# Altium schematic sheet Skumpad.SchDoc
size 279 x 152 mm; ApprovedBy: Skaytacium; CheckedBy: NNNI; Author: Skaytacium; CompanyName: Skaytacium Inc.; Organization: Skaytacium Inc.; DocumentNumber: Skumpad; Revision: 3
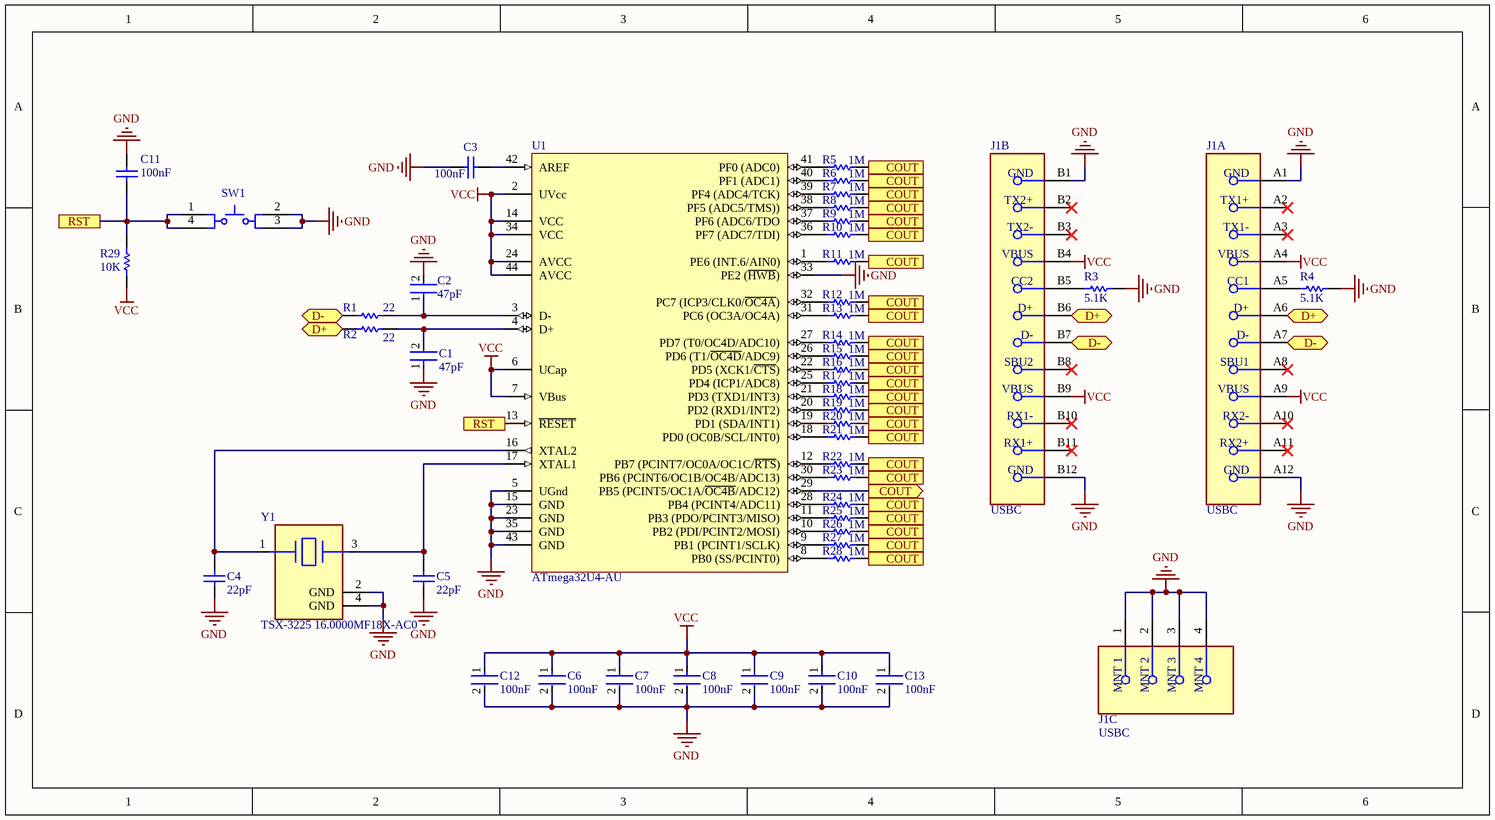
[diagram p0: Skumpad.SchDoc]

## Parts
C1  47pF  [FP-C0402-BB-MFG]
C2  47pF  [FP-C0402-BB-MFG]
C3  100nF  [CAPC1050X55X23ML05T13]
C4  22pF  [CAPC1005X56X25NL10T15]
C5  22pF  [CAPC1005X56X25NL10T15]
C6  100nF  [FP-C0402-BB-MFG]
C7  100nF  [FP-C0402-BB-MFG]
C8  100nF  [FP-C0402-BB-MFG]
C9  100nF  [FP-C0402-BB-MFG]
C10  100nF  [FP-C0402-BB-MFG]
C11  100nF  [CAPC1050X55X23ML05T13]
C12  100nF  [FP-C0402-BB-MFG]
C13  100nF  [FP-C0402-BB-MFG]
J1  USBC  [FP-1054500101-MFG]  (parts A,B,C of 3)
R1  22  [RESC1005X40X25LL05T05]
R2  22  [RESC1005X40X25LL05T05]
R3  5.1K  [RESC1005X40X25NL10T10]
R4  5.1K  [RESC1005X40X25NL10T10]
R5  1M  [RESC0402(1005)_M]
R6  1M  [RESC0402(1005)_M]
R7  1M  [RESC0402(1005)_M]
R8  1M  [RESC0402(1005)_M]
R9  1M  [RESC0402(1005)_M]
R10  1M  [RESC0402(1005)_M]
R11  1M  [RESC0402(1005)_M]
R12  1M  [RESC0402(1005)_M]
R13  1M  [RESC0402(1005)_M]
R14  1M  [RESC0402(1005)_M]
R15  1M  [RESC0402(1005)_M]
R16  1M  [RESC0402(1005)_M]
R17  1M  [RESC0402(1005)_M]
R18  1M  [RESC0402(1005)_M]
R19  1M  [RESC0402(1005)_M]
R20  1M  [RESC0402(1005)_M]
R21  1M  [RESC0402(1005)_M]
R22  1M  [RESC0402(1005)_M]
R23  1M  [RESC0402(1005)_M]
R24  1M  [RESC0402(1005)_M]
R25  1M  [RESC0402(1005)_M]
R26  1M  [RESC0402(1005)_M]
R27  1M  [RESC0402(1005)_M]
R28  1M  [RESC0402(1005)_M]
R29  10K  [RESC1005X40X25NL05T05]
SW1  7914G-1-000E  [BOUR-7914G-1-000E_V]  (value not drawn)
U1  ATmega32U4-AU  [44ML_M]
Y1  TSX-3225 16.0000MF18X-AC0  [FP-TSX-3225-MFG]

## Ports
COUT (out), D+ (bidir), D- (bidir), RST

## Nets
GND: C1.1 C2.2 C3.1 C4.1 C5.1 C6.2 C7.2 C8.2 C9.2 C10.2 C11.2 C12.2 C13.2 J1.1(MNT_1) J1.2(MNT_2) J1.3(MNT_3) J1.4(MNT_4) J1.A1(GND) J1.A12(GND) J1.B1(GND) J1.B12(GND) R3.2 R4.2 SW1.2(+) SW1.3(+) U1.5(UGnd) U1.15(GND) U1.23(GND) U1.33(PE2_(~{HWB})) U1.35(GND) U1.43(GND) Y1.2(GND) Y1.4(GND)
VCC: C6.1 C7.1 C8.1 C9.1 C10.1 C12.1 C13.1 J1.A4(VBUS) J1.A9(VBUS) J1.B4(VBUS) J1.B9(VBUS) R29.1 U1.2(UVcc) U1.6(UCap) U1.7(VBus) U1.14(VCC) U1.24(AVCC) U1.34(VCC) U1.44(AVCC)
COUT: R5.2 R6.2 R7.2 R8.2 R9.2 R10.2 R11.2 R12.2 R13.2 R14.2 R15.2 R16.2 R17.2 R18.2 R19.2 R20.2 R21.2 R22.2 R23.2 R24.2 R25.2 R26.2 R27.2 R28.2 U1.29(PB5_(PCINT5/OC1A/~{OC4B}/ADC12)) ; port COUT
D+: J1.A6(D+) J1.B6(D+) R2.2 ; port D+
D-: J1.A7(D-) J1.B7(D-) R1.2 ; port D-
RST: C11.1 R29.2 SW1.1(-) SW1.4(-) U1.13(~{RESET}) ; port RST
NetC1_2: C1.2 R2.1 U1.4(D+)
NetC2_1: C2.1 R1.1 U1.3(D-)
NetC3_2: C3.2 U1.42(AREF)
NetC4_2: C4.2 U1.16(XTAL2) Y1.1
NetC5_2: C5.2 U1.17(XTAL1) Y1.3
NetJ1_A5: J1.A5(CC1) R4.1
NetJ1_B5: J1.B5(CC2) R3.1
NetR5_1: R5.1 U1.41(PF0_(ADC0))
NetR6_1: R6.1 U1.40(PF1_(ADC1))
NetR7_1: R7.1 U1.39(PF4_(ADC4/TCK))
NetR8_1: R8.1 U1.38(PF5_(ADC5/TMS)))
NetR9_1: R9.1 U1.37(PF6_(ADC6/TDO)
NetR10_1: R10.1 U1.36(PF7_(ADC7/TDI))
NetR11_1: R11.1 U1.1(PE6_(INT.6/AIN0))
NetR12_1: R12.1 U1.32(PC7_(ICP3/CLK0/~{OC4A}))
NetR13_1: R13.1 U1.31(PC6_(OC3A/OC4A))
NetR14_1: R14.1 U1.27(PD7_(T0/OC4D/ADC10))
NetR15_1: R15.1 U1.26(PD6_(T1/~{OC4D}/ADC9))
NetR16_1: R16.1 U1.22(PD5_(XCK1/~{CTS}))
NetR17_1: R17.1 U1.25(PD4_(ICP1/ADC8))
NetR18_1: R18.1 U1.21(PD3_(TXD1/INT3))
NetR19_1: R19.1 U1.20(PD2_(RXD1/INT2))
NetR20_1: R20.1 U1.19(PD1_(SDA/INT1))
NetR21_1: R21.1 U1.18(PD0_(OC0B/SCL/INT0))
NetR22_1: R22.1 U1.12(PB7_(PCINT7/OC0A/OC1C/~{RTS}))
NetR23_1: R23.1 U1.30(PB6_(PCINT6/OC1B/OC4B/ADC13))
NetR24_1: R24.1 U1.28(PB4_(PCINT4/ADC11))
NetR25_1: R25.1 U1.11(PB3_(PDO/PCINT3/MISO))
NetR26_1: R26.1 U1.10(PB2_(PDI/PCINT2/MOSI))
NetR27_1: R27.1 U1.9(PB1_(PCINT1/SCLK))
NetR28_1: R28.1 U1.8(PB0_(SS/PCINT0))

Not connected (* = marked no-connect by the designer): J1 A2(TX1+)* A3(TX1-)* A8(SBU1)* A10(RX2-)* A11(RX2+)* B2(TX2+)* B3(TX2-)* B8(SBU2)* B10(RX1-)* B11(RX1+)*

## Library data of the parts
C1 C2 = CMP-2008-03283-2: CAP CER 47PF 50V C0G/NP0 0402; Manufacturer: Kemet; Manufacturer Part Number: C0402C470J5GACTU; Temperature Coefficient: 15%; Tolerance: 0.05; Material: Ceramic; Temperature Characteristic: C0G; Mouser Description: Multilayer Ceramic Capacitors MLCC - SMD/SMT 50volts 47pF C0G 5%; Capacitance: 47 pF; Automotive: No; ComponentLink2URL: https://content.kemet.com/datasheets/KEM_C1002_X7R_SMD.pdf; Temperature Range High: +125°C; Value: 47 pF; Octopart: https://octopart.com/c0402c470j5gactu-kemet-134668; Category: Cap; Device Class L2: Capacitors; Device Class L3: Ceramic Capacitors; Digikey Description: CAP CER 47PF 50V C0G/NP0 0402; Ipc Land Pattern Name: CAPC10050X50; Voltage Rating: 50 V; Lead Free: Yes; RoHS: TRUE; Device Class L1: Passive Components; Package: C0402-BB; Temperature: -55°C to +125°C; Height: 0.55mm; Temperature Range Low: -55°C; ComponentLink2Description: Datasheet
C3 C11 = CMP-2000-05439-1: Chip Capacitor, 100 nF, +/- 10%, 16 V, -55 to 125 degC, 0402 (1005 Metric), RoHS, Tape and Reel; Manufacturer: Samsung Electro-Mechanics; Capacitance: 100000pF; Dielectric: X7R; Rated Voltage: 16V; Case Size/Dimension: 0402; Tolerance (%): ±10%; Manufacturer URL: http://www.samsungsem.com/global/index.jsp; Datasheet URL: https://datasheet.ciiva.com/29198/458718-da-01-en-vs-kondensator-0402-29198423.pdf; Datasheet Version: Nov-10
C4 C5 = CMP-2008-02613-1: Part Number: 04025A220JAT2A; Manufacturer: AVX Interconnect / Elco
C6-C10 C12 C13 = CMP-03020-023811-1: CAP CER 0.1UF 10V X5R 0402; Manufacturer: Kemet; Manufacturer Part Number: C0402C104K8PACTU; Material: Ceramic; Capacitance: 0.10 μF; Temperature Coefficient: 15%; Tolerance: 0.1; Value: 0.10 μF; Package: C0402-BB; Temperature: -55°C to +125°C; ComponentLink2Description: Datasheet; Temperature Characteristic: X5R; Device Class L1: Passive Components; Height: 0.55mm; Lead Free: Yes; ComponentLink2URL: https://content.kemet.com/datasheets/KEM_C1002_X7R_SMD.pdf; Device Class L2: Capacitors; Temperature Range Low: -55°C; Temperature Range High: +125°C; RoHS: TRUE; Octopart: https://octopart.com/c0402c104k8pactu-kemet-140039; Automotive: No; Mouser Description: Capacitor 100 nF 10 VDC 0402; Category: Cap; Voltage Rating: 10 V; Digikey Description: CAP CER 0.1UF 10V X5R 0402; Ipc Land Pattern Name: CAPC10050X50; Device Class L3: Ceramic Capacitors
J1 = CMP-04767-000004-1: CONN RCP USB3.1 TYPEC 24P SMD RA; Manufacturer: Molex; Manufacturer Part Number: 1054500101; Number Of Contacts: 24; Voltage Rating: 30V; Shielding: true; Is Female: yes; Current Rating: 0.25/1.25/5A; Pitch: 0.5mm; Conn Orientation: Right Angle; Package: 0; Height: 3.44mm; Footprint Url: https://www.molex.com/pdm_docs/sd/1054500101_sd.pdf; Device Class L1: Connectors; Category: Conn; Device Class L2: USB Connectors; Digikey Description: CONN RCP USB3.1 TYPEC 24P SMD RA; Contact Material: Gold,Nickel; Mouser Description: USB Shielded I/O Receptacle; Type C; Right Angle; Surface Mount; Gold over Nickel; ComponentLink2Description: Datasheet; Lead Free: Yes; Automotive: No; Temperature Range High: +85°C; RoHS: TRUE; Octopart: https://octopart.com/105450-0101-molex-68082325; ComponentLink2URL: https://www.molex.com/webdocs/datasheets/pdf/en-us/1054500101_IO_CONNECTORS.pdf; Temperature: -30°C to +85°C; Usb Standard: USB 3.1; Temperature Range Low: -30°C; Device Class L3: unset
R1 R2 = CMP-2002-08382-1: Manufacturer: Vishay Dale; Part Number: CRCW040222R0FKED
R3 R4 = CMP-2002-05812-1: Manufacturer: Panasonic; Part Number: ERA-2AEB512X
R5-R28 = CMP-1011-00849-1: 1M 0.063W 1% 0402 (1005 Metric)  SMD; Case-Metric: 1005; Value: 1000000.00 Ohm; Case-EIA: 0402; Tolerance: 1 %; Power: 0.063 W; Technology: SMT
R29 = CMP-2002-01183-1: Part Number: ERT-J0ER103J; Manufacturer: Panasonic
SW1 = CMP-2000-05692-1: SPST Gull Wing Sealed Key Switch, 100 mA, 16 V, -55 to 125 degC, 4-Pin SMD, RoHS, Tape and Reel; Manufacturer: Bourns; COO: TW; Actuator Length: 1.65mm; Maximum Contact Resistance: 100mOhm; Ground Terminal: No; Mechanical Life: 100000Cycles; Contact Rating @ Voltage: 0.1A; Illumination Type: N/R; Body Orientation: Straight; Dielectric Strength: 250VAC; Maximum DC Voltage Rating: 16V; Base Material: Thermoplastic; Operating Force: 2.94N; Actuator Style: RoundButton; Switch Configuration: N.O.; Mounting: SurfaceMount,GullWing; Electrical Life: N/A; Seal Description: N/A; Datasheet Version: 08/2016; ECCN: EAR99; Product Weight: N/A; Seal Location: N/A; Actuator Color: N/A; Dimension: 5x6.2x4.19mm; Manufacturer URL: http://www.bourns.com/; Packaging: EmbossedTapeandReel; RoHS: Yes; Part No: 7914G-1-000E; Pole Throw Configuration: SPST; Supplier: Bourns; Type: KeySwitch; Mounting Technology: SurfaceMount; Datasheet URL: http://www.bourns.com/docs/Product-Datasheets/7914.pdf; Package Reference: 7914G-1-000E; Contact Material: Gold; Family: 7914; Housing Material: N/A; Minimum Insulation Resistance: 100MOhm; HTS: 8536509065; Contact Plating: N/A; Operating Temperature: -55to125C; Package Description: 4-Pin Surface Mount Device, Body 5 x 5 mm, Height 4.49 mm; Maximum AC Voltage Rating: 16V
U1 = CMP-0095-00285-2: 8-bit AVR Microcontroller, 2.7-5.5V, 16MHz, 32KB Flash, 1KB EEPROM, 2.5KB SRAM, USB Controller, 44-pin TQFP, Industrial Grade (-40°C to 85°C), Ext Osc; RevisionNote: DatasheetVersion updated. URLs added.; ComponentLink1Description: Manufacturer URL; PackageDescription: 44-Pin Plastic Thin Quad Flat Pack, 10 x 10 x 1.0 mm Body, 0.8 mm Pitch (TQFP); DatasheetVersion: revF, Nov-2010; ComponentLink2URL: http://www.atmel.com/dyn/resources/prod_documents/doc7766.pdf; ComponentLink1URL: http://www.atmel.com/; PackageReference: 44ML; ComponentLink2Description: ATmega16U4/32U4 Datasheet; PackageVersion: rev.G, Jul-2007; ComponentLink3URL: http://www.atmel.com/dyn/resources/prod_documents/7766S.pdf; ComponentLink3Description: ATmega16U4 ATmega32U4 Summary
Y1 = CMP-36405-000005-1: CRYSTAL 16.00 MHZ 9PF SMD; Manufacturer: EPSON; Stability: 18ppm; Esr: 60Ω; Frequency: 16MHz; Tolerance: 10ppm; Series: TSX-3225; Manufacturer Part Number: TSX-3225 16.0000MF18X-AC0; Temperature Range High: +85°C; ComponentLink2URL: https://support.epson.biz/td/api/doc_check.php?dl=brief_TSX-3225&lang=en; Temperature Range Low: -40°C; RoHS: TRUE; Lead Free: Yes; Mouser Description: CRYSTAL 16.00 MHZ 9PF SMD; Category: Crys; Temperature: -40°C to +85°C; Device Class L1: Passive Components; Height: 0.6mm; Octopart: https://octopart.com/tsx-3225+16.0000mf18x-ac0-epson-58756552; Automotive: No; Digikey Description: CRYSTAL 16.00 MHZ 9PF SMD; ComponentLink2Description: Datasheet; Load Capacitance: 9pF; Package: TSX-3225; Device Class L3: Crystals; Device Class L2: Crystals / Oscillators